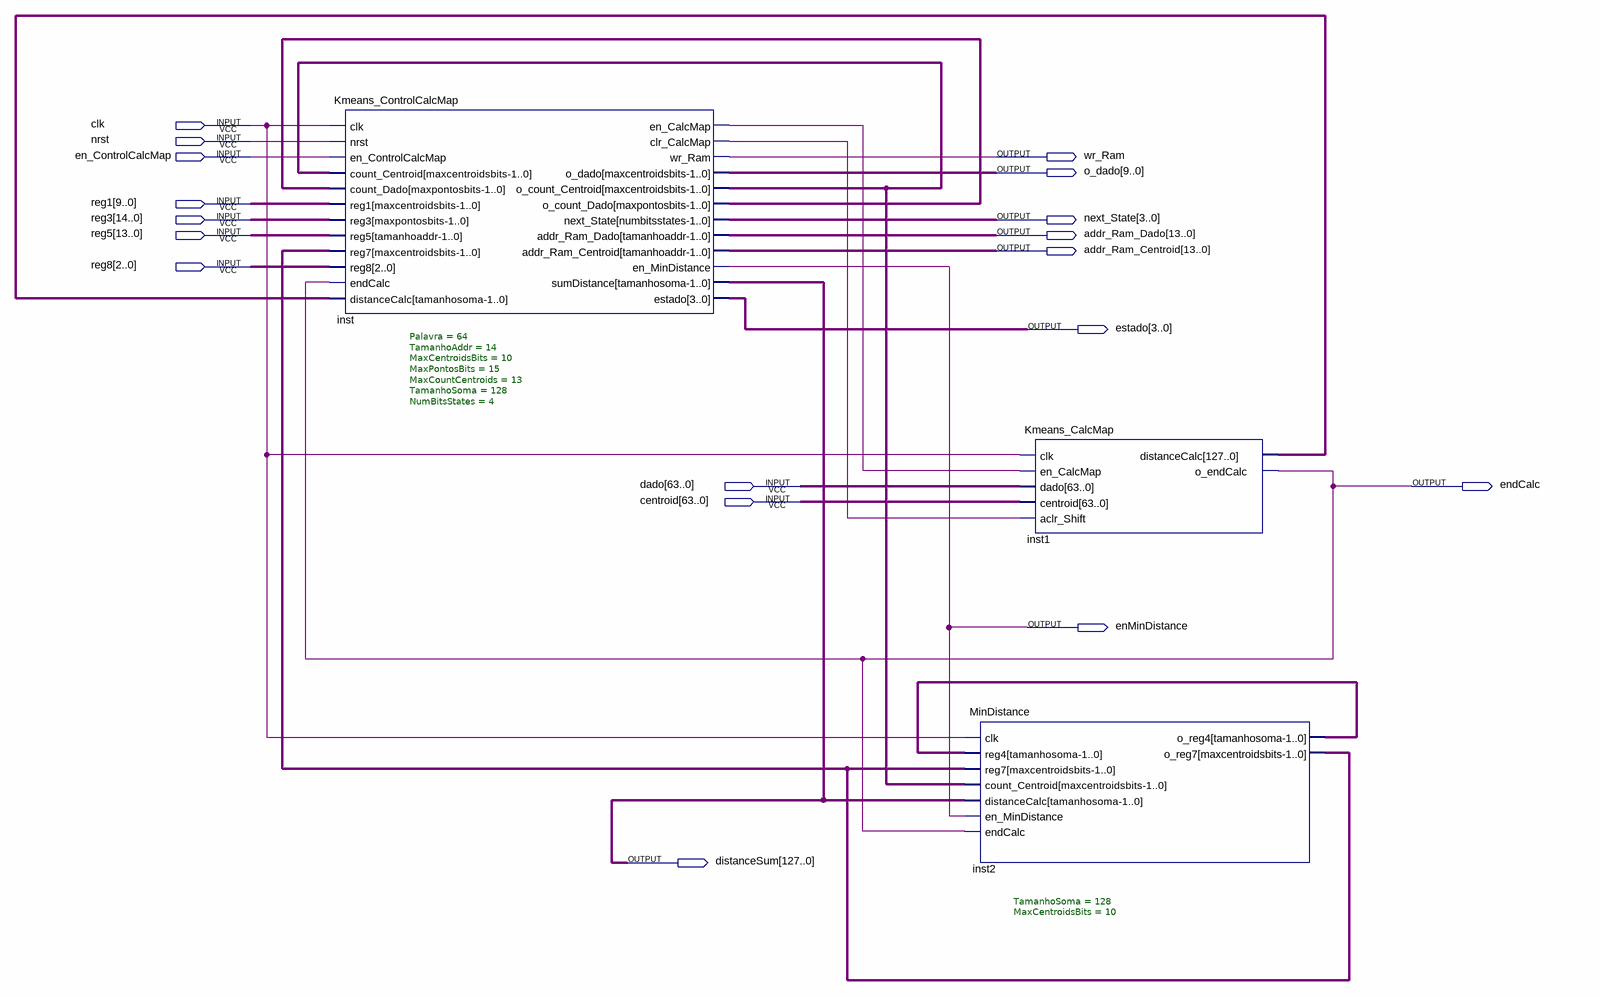
[diagram p0: schematic sheet]
// Quartus schematic Kmeans_CalcMapModule.bdf as structural Verilog: 3 symbols, 18 pins
module Kmeans_CalcMapModule (
  input  clk,
  input  nrst,
  input  en_ControlCalcMap,
  input  [9:0] reg1,
  input  [14:0] reg3,
  input  [13:0] reg5,
  input  [2:0] reg8,
  input  [63:0] dado,
  input  [63:0] centroid,
  output wr_Ram,
  output [9:0] o_dado,
  output [3:0] next_State,
  output [13:0] addr_Ram_Dado,
  output [13:0] addr_Ram_Centroid,
  output [3:0] estado,
  output endCalc,
  output enMinDistance,
  output [127:0] distanceSum
);

  wire inst_clr_calcmap, inst_en_calcmap;
  wire [9:0] inst2_o_reg7, inst_o_count_centroid;
  wire [14:0] inst_o_count_dado;
  wire [127:0] inst1_distancecalc, inst2_o_reg4;

  Kmeans_ControlCalcMap #(.Palavra(64), .TamanhoAddr(14), .MaxCentroidsBits(10), .MaxPontosBits(15), .MaxCountCentroids(13), .TamanhoSoma(128), .NumBitsStates(4)) inst (
    .clk(clk), .nrst(nrst), .en_ControlCalcMap(en_ControlCalcMap), .count_Centroid(inst_o_count_centroid),
    .count_Dado(inst_o_count_dado), .reg1(reg1), .reg3(reg3), .reg5(reg5), .reg7(inst2_o_reg7), .reg8(reg8),
    .endCalc(endCalc), .distanceCalc(inst1_distancecalc), .en_CalcMap(inst_en_calcmap),
    .clr_CalcMap(inst_clr_calcmap), .wr_Ram(wr_Ram), .o_dado(o_dado),
    .o_count_Centroid(inst_o_count_centroid), .o_count_Dado(inst_o_count_dado), .next_State(next_State),
    .addr_Ram_Dado(addr_Ram_Dado), .addr_Ram_Centroid(addr_Ram_Centroid), .en_MinDistance(enMinDistance),
    .sumDistance(distanceSum), .estado(estado));
  MinDistance #(.TamanhoSoma(128), .MaxCentroidsBits(10)) inst2 (
    .clk(clk), .reg4(inst2_o_reg4), .reg7(inst2_o_reg7), .count_Centroid(inst_o_count_centroid),
    .distanceCalc(distanceSum), .en_MinDistance(enMinDistance), .endCalc(endCalc), .o_reg4(inst2_o_reg4),
    .o_reg7(inst2_o_reg7));
  Kmeans_CalcMap inst1 (
    .clk(clk), .en_CalcMap(inst_en_calcmap), .dado(dado), .centroid(centroid), .aclr_Shift(inst_clr_calcmap),
    .distanceCalc(inst1_distancecalc), .o_endCalc(endCalc));
endmodule
